# EasyEDA Pro project USB4 OF 1.eprj

# Schematic Schematic2
Board Name: PCB2; Create Date: 2025-10-10; Page Name: P1; Project Name: USB4 OF 1; Schematic Name: Schematic2; Update Date: 2025-10-12; Company: 嘉立创EDA; Page Size: A4; Version: V1.0
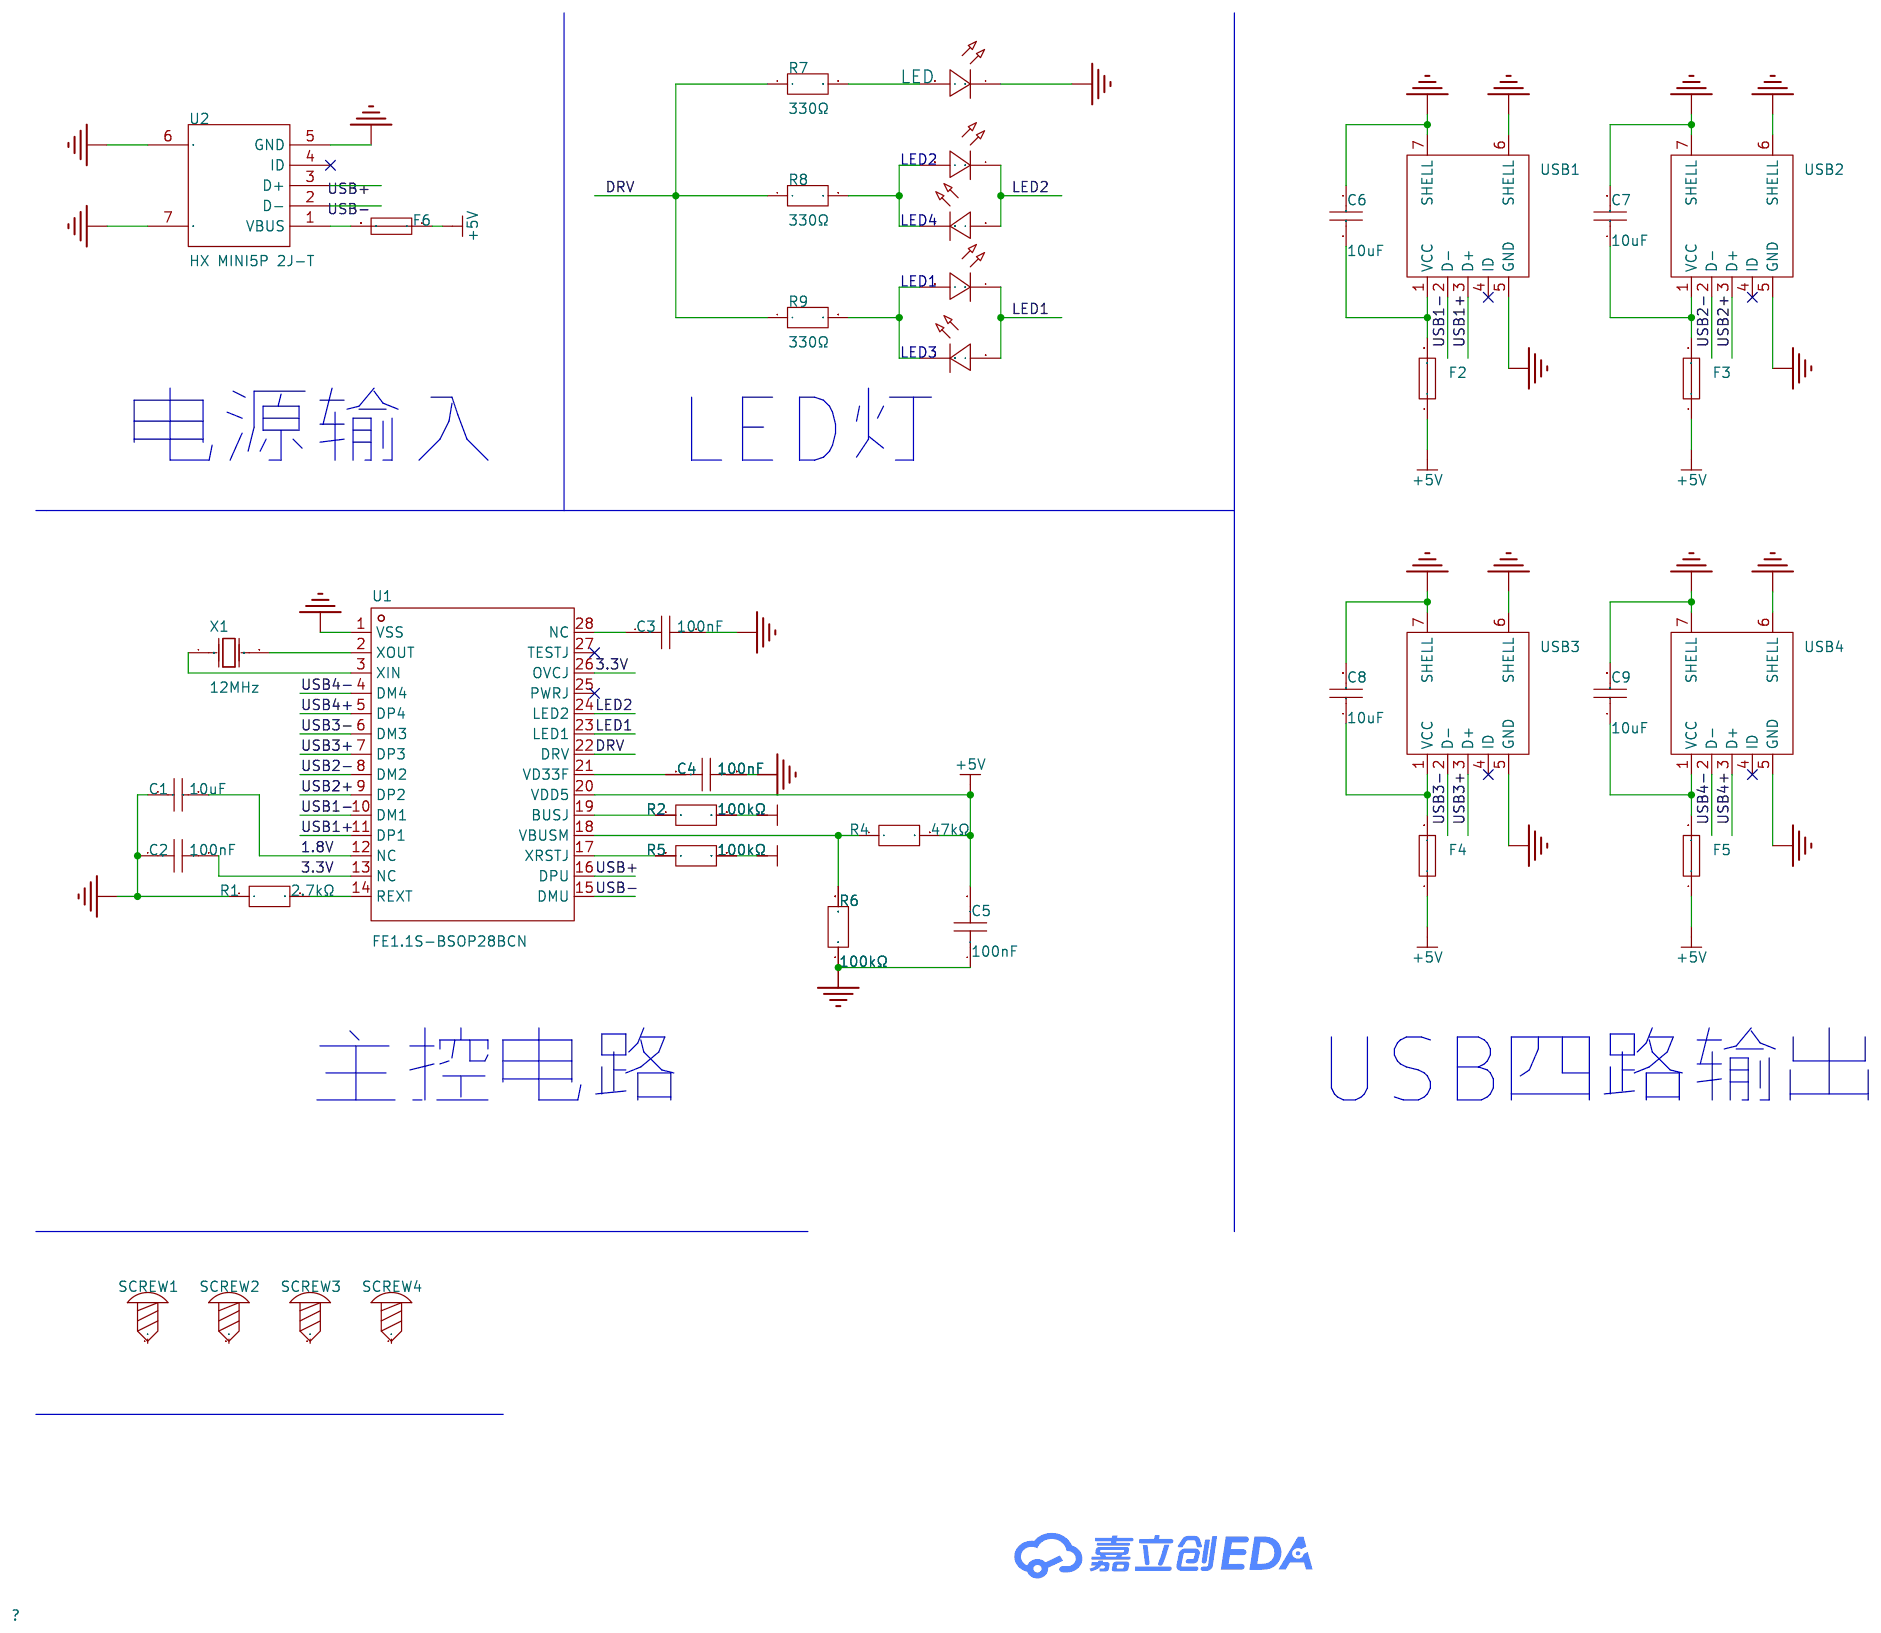
[diagram p0: schematic sheet]

## Parts
C1  10uF  [C0805]
C2  100nF  [C0402]
C3  100nF  [C0402]
C4  100nF  [C0402]
C5  100nF  [C0402]
C6  10uF  [C0805]
C7  10uF  [C0805]
C8  10uF  [C0805]
C9  10uF  [C0805]
F2  SMD1206-050  [F1206]
F3  SMD1206-050  [F1206]
F4  SMD1206-050  [F1206]
F5  SMD1206-050  [F1206]
F6  SMD1206-050  [F1206]
LED  -  [LED_0603]
LED1  -  [LED_0603]
LED2  -  [LED_0603]
LED3  -  [LED_0603]
LED4  -  [LED_0603]
R1  2.7kΩ  [R0603]
R2  100kΩ  [R0603]
R4  47kΩ  [R0805]
R5  100kΩ  [R0603]
R6  100kΩ  [R0603]
R7  330Ω  [R0402]
R8  330Ω  [R0402]
R9  330Ω  [R0402]
SCREW1  -  [M3螺丝]
SCREW2  -  [M3螺丝]
SCREW3  -  [M3螺丝]
SCREW4  -  [M3螺丝]
U1  FE1.1S-BSOP28BCN  [SSOP-28_L9.9-W3.9-P0.635-LS6.0-BL-1]
U2  HX MINI5P 2J-T  [USB-MINI-SMD_HX-MINI5P-2J-T]
USB1  MINI5P 180°T  [MINI-USB-TH_MINI5P-180T]
USB2  MINI5P 180°T  [MINI-USB-TH_MINI5P-180T]
USB3  MINI5P 180°T  [MINI-USB-TH_MINI5P-180T]
USB4  MINI5P 180°T  [MINI-USB-TH_MINI5P-180T]
X1  12MHz  [CRYSTAL-SMD_L7.0-W4.0-LS7.8]

## Library data of the parts
C1 C6-C9 = CL21A106KOQNNNE: 容值:10uF;精度:±10%;额定电压:16V;温度系数:X5R;; LCSC Part Name: 10uF ±10% 16V; Supplier Part: C1713; Manufacturer: SAMSUNG(三星); Supplier Footprint: 0805; JLCPCB Part Class: 扩展库; Datasheet: https://item.szlcsc.com/datasheet/CL21A106KOQNNNE/2065.html; Supplier: LCSC; Tolerance: ±10%; Voltage Rating: 16V; Temperature Coefficient: X5R
C2-C5 = CL05B104KO5NNNC: 容值:100nF;精度:±10%;额定电压:16V;温度系数:X7R;; LCSC Part Name: 100nF ±10% 16V; Supplier Part: C1525; Manufacturer: SAMSUNG(三星); Supplier Footprint: 0402; JLCPCB Part Class: 基础库; Datasheet: https://item.szlcsc.com/datasheet/CL05B104KO5NNNC/1877.html; Supplier: LCSC; Tolerance: ±10%; Voltage Rating: 16V; Temperature Coefficient: X7R
F2-F6 = SMD1206-050: 耐压(Vmax):6V;最大电流(Imax):8A;保持电流(Ihold):500mA;跳闸电流(Itrip):1A;; Supplier Part: C48995616; Manufacturer: Semiwell(矽门微); Supplier Footprint: 1206; JLCPCB Part Class: 扩展库; Datasheet: https://item.szlcsc.com/datasheet/SMD1206-050/51331345.html; Supplier: LCSC; Voltage - Max: 6V; Current - Max: 8A; Hold Current: 500mA; Trip Current: 1A; Power Dissipation: 600mW; Resistance - Initial (Ri) (Min): 150mΩ; Resistance - Post Trip (R1) (Max): 700mΩ; Time to Trip(Max): 100ms; Operating Temperature: -40℃~+85℃; Length: 3.6mm; Width: 1.9mm; Height: 1.2mm
LED = LED_0603-R: Supplier Footprint: 0603
LED1-LED4 = LED_0603-G: Supplier Footprint: 0603
R1 = FRC0603F2701TS: 电阻类型:厚膜电阻;阻值:2.7kΩ;精度:±1%;功率:100mW;工作电压:75V;温度系数:±100ppm/℃;; LCSC Part Name: 2.7kΩ ±1% 100mW 厚膜电阻; Supplier Part: C2907008; Manufacturer: FOJAN(富捷); Supplier Footprint: 0603; JLCPCB Part Class: 扩展库; Supplier: LCSC; Type: 厚膜电阻; Tolerance: ±1%; Power(Watts): 100mW; Voltage-Supply(Max): 75V; Temperature Coefficient: ±100ppm/℃; Operating Temperature: -55℃~+155℃
R2 R5 R6 = FRC0603J104 TS: 电阻类型:厚膜电阻;阻值:100kΩ;精度:±5%;功率:100mW;工作电压:75V;温度系数:±100ppm/℃;; LCSC Part Name: 100kΩ ±5% 100mW 厚膜电阻; Supplier Part: C2907088; Manufacturer: FOJAN(富捷); Supplier Footprint: 0603; JLCPCB Part Class: 扩展库; Supplier: LCSC; Type: 厚膜电阻; Tolerance: ±5%; Power(Watts): 100mW; Voltage-Supply(Max): 75V; Temperature Coefficient: ±100ppm/℃; Operating Temperature: -55℃~+155℃
R4 = FRC0805J473 TS: 电阻类型:厚膜电阻;阻值:47kΩ;精度:±5%;功率:125mW;工作电压:150V;温度系数:±100ppm/℃;; LCSC Part Name: 47kΩ ±5% 125mW 厚膜电阻; Supplier Part: C2907330; Manufacturer: FOJAN(富捷); Supplier Footprint: 0805; JLCPCB Part Class: 扩展库; Supplier: LCSC; Type: 厚膜电阻; Tolerance: ±5%; Power(Watts): 125mW; Voltage-Supply(Max): 150V; Temperature Coefficient: ±100ppm/℃; Operating Temperature: -55℃~+155℃
R7-R9 = FRC0402J331 TS: 电阻类型:厚膜电阻;阻值:330Ω;精度:±5%;功率:62.5mW;工作电压:50V;温度系数:±100ppm/℃;; LCSC Part Name: 330Ω ±5% 62.5mW 厚膜电阻; Supplier Part: C2906929; Manufacturer: FOJAN(富捷); Supplier Footprint: 0402; JLCPCB Part Class: 扩展库; Supplier: LCSC; Type: 厚膜电阻; Tolerance: ±5%; Power(Watts): 62.5mW; Voltage-Supply(Max): 50V; Temperature Coefficient: ±100ppm/℃; Operating Temperature: -55℃~+155℃
SCREW1-SCREW4 = M3螺丝: Supplier Footprint: 插件
U1 = FE1.1S-BSOP28BCN: 应用功能:-;接口协议:-;; LCSC Part Name: FE1.1s - USB 2.0高速4端口集线器控制器; Supplier Part: C9359; Manufacturer: TERMINUS; Supplier Footprint: SSOP-28-150mil; JLCPCB Part Class: 扩展库; Datasheet: https://atta.szlcsc.com/upload/public/pdf/source/20230317/CF3CD0767291E55840676FE9156E5488.pdf; Supplier: LCSC
U2 = HX MINI5P 2J-T: LCSC Part Name: Mini-B 母 弯插; Supplier Part: C19189144; Manufacturer: hanxia(韩下); Supplier Footprint: 弯插; JLCPCB Part Class: 扩展库; Datasheet: https://item.szlcsc.com/datasheet/HX%2520MINI5P%25202J-T/20414140.html; Supplier: LCSC; Connector Type: Mini-B; Protocol Standard: USB 2.0; Gender: 母; Mounting Type: 弯插; Number of Contacts: 5P; Number of Ports: 1; Current Rating-Power: 1A; Voltage Rating: 30V; Connect-Disconnect Life: 3千次; Length: 9.2mm; Detection color: 黑色; Operating Temperature: -30℃~+80℃
USB1-USB4 = MINI5P 180°T: 连接器类型:Mini-B;协议标准:USB 2.0;公母:母;安装方式:直插;触点数量:5P;端口数量:1;额定电流 - 电源:1A;工作温度:-25℃~+85℃;; LCSC Part Name: Mini-B 母 弯插; Supplier Part: C6331167; Manufacturer: SHOU HAN(首韩); Supplier Footprint: 插件; JLCPCB Part Class: 扩展库; Datasheet: https://item.szlcsc.com/datasheet/MINI5P%2520180%25C2%25B0T/7279360.html; Supplier: LCSC; Connector Type: Mini-B; Protocol Standard: USB 2.0; Gender: 母; Mounting Type: 直插; Number of Contacts: 5P; Number of Ports: 1; Current Rating-Power: 1A; Voltage Rating: 30V; Connect-Disconnect Life: 3千次; Length: 9.5mm; Detection color: 黑色; Operating Temperature: -25℃~+85℃
X1 = 12M 20PF 10PPM: 频率:12MHz;常温频差:±10ppm;负载电容:20pF;频率稳定度:±30ppm;; LCSC Part Name: 12MHz ±10ppm 20pF; Supplier Part: C2975358; Manufacturer: SOSET(索斯特); Supplier Footprint: HC-49S-SMD-2P-Mini; JLCPCB Part Class: 扩展库; Datasheet: https://item.szlcsc.com/datasheet/12M%252020PF%252010PPM/3379869.html; Supplier: LCSC; Normal temperature Frequency Tolerance: ±10ppm; Load Capacitance: 20pF; Frequency Stability: ±30ppm; Operating Temperature: -20℃~+70℃

## Nets
1.8V: C1.2 U1.12(NC)
3.3V: C2.2 R2.2 R5.2 U1.13(NC) U1.26(OVCJ)
+5V: C5.2 F2.1 F3.1 F4.1 F5.1 F6.1 R4.2 U1.20(VDD5)
GND: C1.1 C2.1 C3.2 C4.2 C5.1 C6.1 C7.2 C8.2 C9.2 LED.1(C) R1.1 R6.1 U1.1(VSS) U2.5(GND) U2.6(EH) U2.7(EH) USB1.5(GND) USB1.6(SHELL) USB1.7(SHELL) USB2.5(GND) USB2.6(SHELL) USB2.7(SHELL) USB3.5(GND) USB3.6(SHELL) USB3.7(SHELL) USB4.5(GND) USB4.6(SHELL) USB4.7(SHELL)
DRV: R7.1 R8.1 R9.1 U1.22(DRV)
LED1: LED1.1(C) LED3.2(A) U1.23(LED1)
LED2: LED2.1(C) LED4.2(A) U1.24(LED2)
USB1+: U1.11(DP1) USB1.3(D+)
USB1-: U1.10(DM1) USB1.2(D-)
USB2+: U1.9(DP2) USB2.3(D+)
USB2-: U1.8(DM2) USB2.2(D-)
USB3+: U1.7(DP3) USB3.3(D+)
USB3-: U1.6(DM3) USB3.2(D-)
USB4+: U1.5(DP4) USB4.3(D+)
USB4-: U1.4(DM4) USB4.2(D-)
USB+: U1.16(DPU) U2.3(D+)
USB-: U1.15(DMU) U2.2(D-)
$1N1246: U1.2(XOUT) X1.2(OSC2)
$1N1259: U1.3(XIN) X1.1(OSC1)
$1N1264: R1.2 U1.14(REXT)
$1N1680: C3.1 U1.28(NC)
$1N1741: C4.1 U1.21(VD33F)
$1N1878: R2.1 U1.19(BUSJ)
$1N1882: R5.1 U1.17(XRSTJ)
$1N2115: R4.1 R6.2 U1.18(VBUSM)
$1N2721: C6.2 F2.2 USB1.1(VCC)
$1N3229: C7.1 F3.2 USB2.1(VCC)
$1N3435: C8.1 F4.2 USB3.1(VCC)
$1N3641: C9.1 F5.2 USB4.1(VCC)
$1N3817: LED.2(A) R7.2
$1N3890: LED2.2(A) LED4.1(C) R8.2
$1N3921: LED1.2(A) LED3.1(C) R9.2
Net-(F6-2): F6.2 U2.1(VBUS)

Not connected (* = marked no-connect by the designer): SCREW1 1; SCREW2 1; SCREW3 1; SCREW4 1; U1 25(PWRJ)* 27(TESTJ)*; U2 4(ID)*; USB1 4(ID)*; USB2 4(ID)*; USB3 4(ID)*; USB4 4(ID)*

## Notes on the sheet
- 电源输入
- LED灯
- 主控电路
- USB四路输出

# Board PCB2
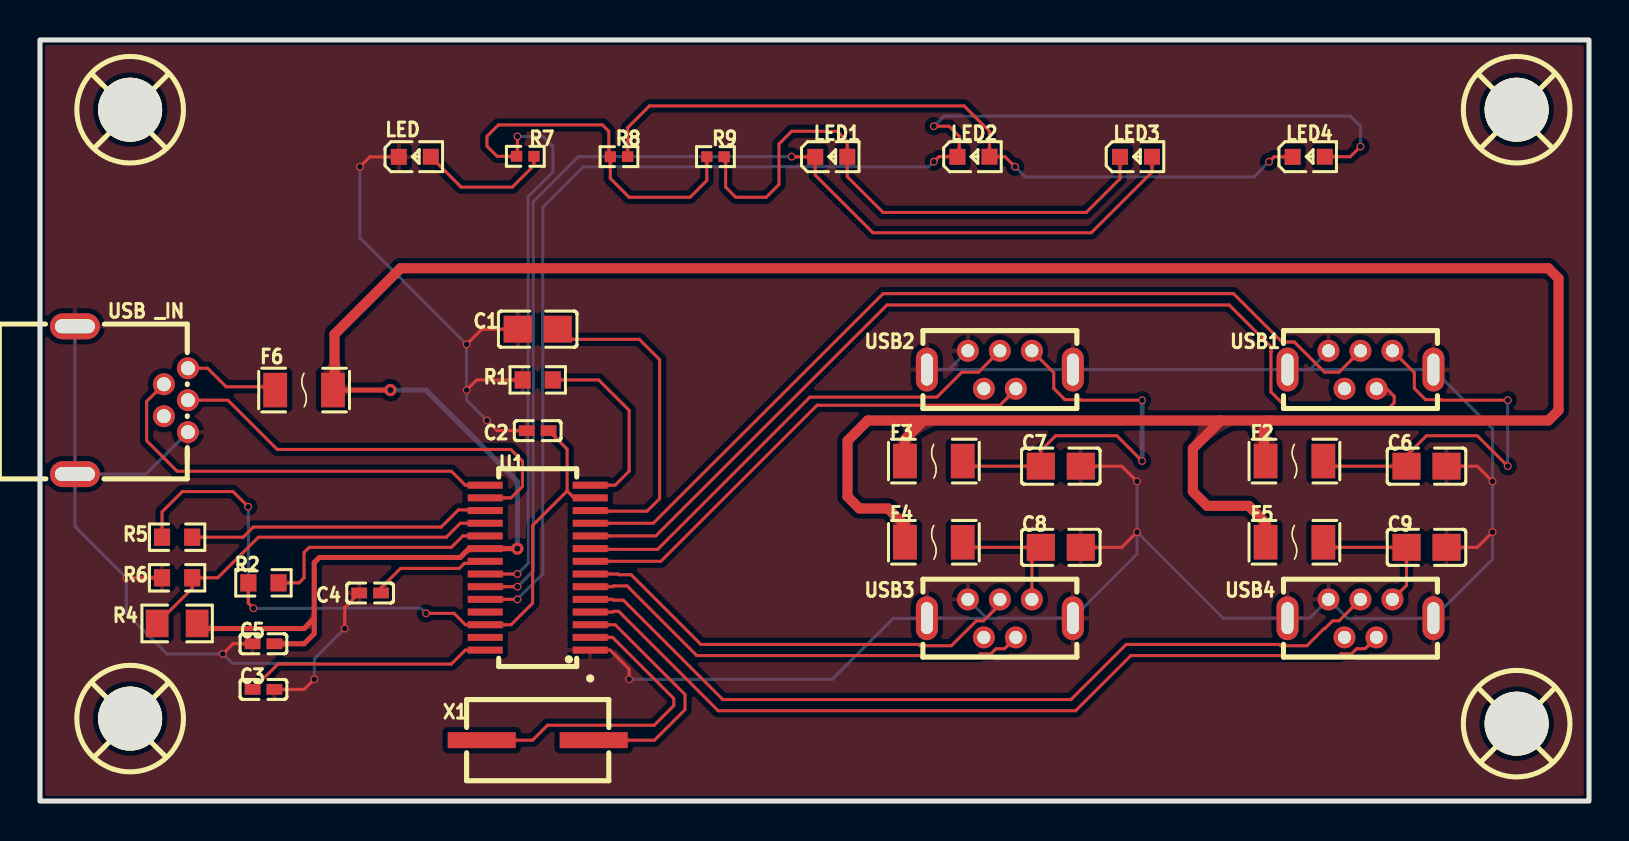
[diagram p1: board, top side]
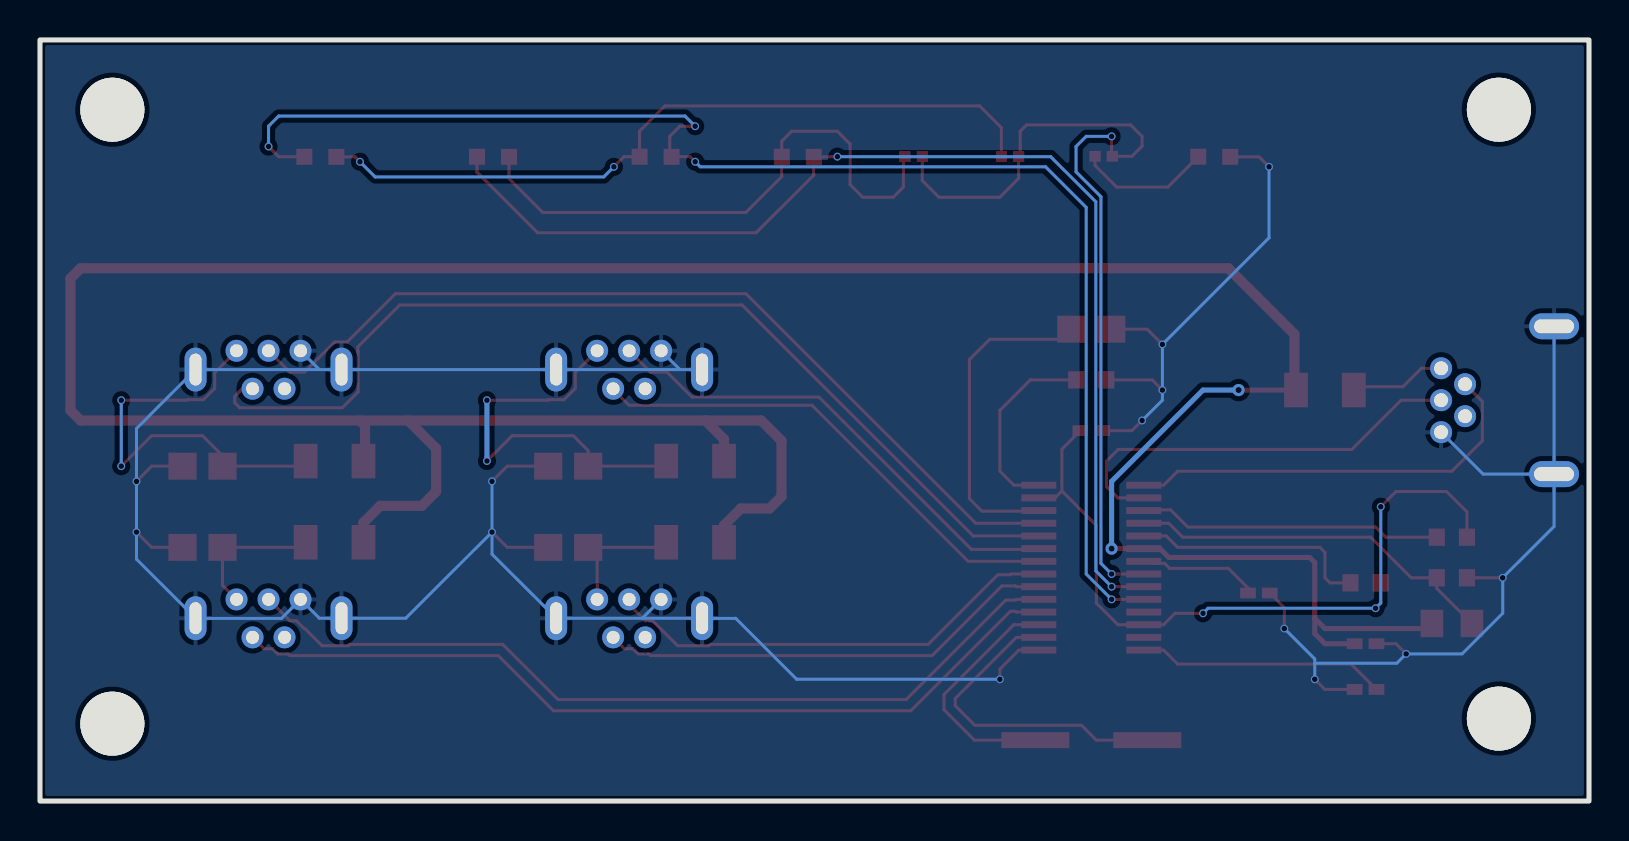
[diagram p2: board, bottom side, seen from below]

Outline 77.47 x 38.1 mm; copper layers: Top Layer, Bottom Layer. Coordinates in mm from the lower left corner of the outline.
Outline path: rectangle 0,38.1 77.47,0
Stack: Top Layer 0.035mm / Dielectric1 1.51mm FR4 er 4.5 / Bottom Layer 0.035mm

## Design rules (mm)
net USB+: DP1
net USB-: DP1
net USB1+: USB1
net USB1-: USB1
net USB2+: USB2
net USB2-: USB2
net USB3+: USB3
net USB3-: USB3
net USB4+: USB4
net USB4-: USB4
template: 自定义配置
spacing copperThickness1oz (default): track to track 0.102, other pairs 0.152 to 0.3
spacing copperThickness2oz: track to track 0.203, other pairs 0.152 to 0.3
track width copperThickness1oz (default): min 0.127, default 0.254, max 2.54
track width copperThickness2oz: min 0.203, default 0.254, max 2.54
differential pair differentialPair (default): width min 0.127, default 0.254, max 2.54; gap min 0.001, default 0.305
via viaSize (default): diameter min 0.356, default 0.394, max 10; hole min 0.254, default 0.279, max 6.3

## Placement (name value [footprint] x y rotation side)
C1  10uF  [C0805]  24.89 23.62 0 top
C2  100nF  [C0402]  24.89 18.54 0 top
C3  100nF  [C0402]  11.18 5.59 0 top
C4  100nF  [C0402]  16.51 10.41 180 top
C5  100nF  [C0402]  11.18 7.87 0 top
C6  10uF  [C0805]  69.34 16.76 180 top
C7  10uF  [C0805]  51.05 16.76 0 top
C8  10uF  [C0805]  51.05 12.7 0 top
C9  10uF  [C0805]  69.34 12.7 0 top
F2  SMD1206-050  [F1206]  62.74 17.02 0 top
F3  SMD1206-050  [F1206]  44.7 17.02 0 top
F4  SMD1206-050  [F1206]  44.7 12.95 0 top
F5  SMD1206-050  [F1206]  62.74 12.95 0 top
F6  SMD1206-050  [F1206]  13.21 20.57 180 top
LED  -  [LED_0603]  18.8 32.26 0 top
LED1  -  [LED_0603]  39.62 32.26 0 top
LED2  -  [LED_0603]  46.74 32.26 0 top
LED3  -  [LED_0603]  54.86 32.26 0 top
LED4  -  [LED_0603]  63.5 32.26 0 top
R1  2.7kΩ  [R0603]  24.89 21.08 0 top
R2  100kΩ  [R0603]  11.18 10.92 180 top
R4  47kΩ  [R0805]  6.86 8.89 0 top
R5  100kΩ  [R0603]  6.86 13.21 180 top
R6  100kΩ  [R0603]  6.86 11.18 0 top
R7  330Ω  [R0402]  24.27 32.28 0 top
R8  330Ω  [R0402]  28.96 32.26 0 top
R9  330Ω  [R0402]  33.78 32.26 0 top
SCREW1  -  [M3螺丝]  4.57 34.54 0 top
SCREW2  -  [M3螺丝]  4.57 4.06 0 top
SCREW3  -  [M3螺丝]  73.91 34.54 0 top
SCREW4  -  [M3螺丝]  73.91 3.81 0 top
U1  FE1.1S-BSOP28BCN  [SSOP-28_L9.9-W3.9-P0.635-LS6.0-BL-1]  24.89 11.68 90 top
USB1  MINI5P 180°T  [MINI-USB-TH_MINI5P-180T]  66.04 21.59 0 top
USB2  MINI5P 180°T  [MINI-USB-TH_MINI5P-180T]  48.01 21.59 0 top
USB3  MINI5P 180°T  [MINI-USB-TH_MINI5P-180T]  48.01 9.14 0 top
USB4  MINI5P 180°T  [MINI-USB-TH_MINI5P-180T]  66.04 9.14 0 top
USB _IN  HX MINI5P 2J-T  [USB-MINI-SMD_HX-MINI5P-2J-T]  4.57 20.07 270 top
X1  12MHz  [CRYSTAL-SMD_L7.0-W4.0-LS7.8]  24.89 3.05 180 top

## Footprints (pads in the part's own frame, mm; a bottom-side part is the same pattern mirrored in y, then rotated)
C0402
  rect 0.79x0.54 smd: 1(-0.545,0) 2(0.545,0)
C0805
  rect 1.41x1.35 smd: 1(-1,0) 2(1,0)
CRYSTAL-SMD_L7.0-W4.0-LS7.8
  rect 3.4x0.8 smd: 1(-2.8,0) 2(2.8,0)
F1206
  rect 1.19x1.728 smd: 1(-1.445,0) 2(1.445,0)
LED_0603
  rect 0.8x0.8 smd: 1(-0.851,-0.01) 2(0.75,-0.005)
M3螺丝
  round 3.2 hole 3.2: 1(-0.064,0.064)
MINI-USB-TH_MINI5P-180T
  round 1.1 hole 0.65: 1(1.6,0.95) 2(0.8,-0.95) 3(0,0.95) 4(-0.8,-0.95) 5(-1.6,0.95)
  oval 1.1x2.2 hole 0.6x1.6: 6(3.65,0.01) 7(-3.65,0.01)
R0402
  rect 0.566x0.54 smd: 1(-0.433,0) 2(0.433,0)
R0603
  rect 0.806x0.864 smd: 1(-0.753,0) 2(0.753,0)
R0805
  rect 1.133x1.377 smd: 1(-1,0) 2(1,0)
SSOP-28_L9.9-W3.9-P0.635-LS6.0-BL-1
  rect 0.35x1.751 smd: 1(-4.128,-2.626) 2(-3.493,-2.626) 3(-2.857,-2.626) 4(-2.223,-2.626) 5(-1.587,-2.626) 6(-0.953,-2.626) 7(-0.318,-2.626) 8(0.318,-2.626) 9(0.953,-2.626) 10(1.587,-2.626) 11(2.223,-2.626) 12(2.857,-2.626) 13(3.493,-2.626) 14(4.128,-2.626) 15(4.128,2.626) 16(3.493,2.626) 17(2.857,2.626) 18(2.223,2.626) 19(1.587,2.626) 20(0.953,2.626) 21(0.318,2.626) 22(-0.318,2.626) 23(-0.953,2.626) 24(-1.587,2.626) 25(-2.223,2.626) 26(-2.857,2.626) 27(-3.493,2.626) 28(-4.128,2.626)
USB-MINI-SMD_HX-MINI5P-2J-T
  round 1.1 hole 0.7: 1(-1.6,2.825) 2(-0.8,1.625) 3(0,2.825) 4(0.8,1.625) 5(1.6,2.825)
  oval 1.3x2.5 hole 0.7x2: 6(3.7,-2.825) 7(-3.7,-2.825)

## Nets
As in the schematic, except:
GND: C1.1 C2.1 C3.2 C4.2 C5.1 C6.1 C7.2 C8.2 C9.2 LED.1 R1.1 R6.1 U1.1 USB1.5 USB1.6 USB1.7 USB2.5 USB2.6 USB2.7 USB3.5 USB3.6 USB3.7 USB4.5 USB4.6 USB4.7 USB _IN.5 USB _IN.6 USB _IN.7
USB+: U1.16 USB _IN.3
USB-: U1.15 USB _IN.2
$1N7306: F6.2 USB _IN.1

Pads without a net: SCREW1 1; SCREW2 1; SCREW3 1; SCREW4 1; U1 25 27; USB1 4; USB2 4; USB3 4; USB4 4; USB _IN 4

## Via types
v1: diameter 0.394, hole 0.28, Top Layer to Bottom Layer, 30 vias
v2: diameter 0.61, hole 0.305, Top Layer to Bottom Layer, 2 vias

## Routing (per net, layer and track width the routed paths; a pad name or vN(x,y) marks a point on that pad's centre or on a via; arc(x,y) is an arc through that point)
1.8V: length 16.4
  Top Layer w0.152: C1.2 26.4,23.11 29.97,23.11 30.99,22.1 30.99,15.14 30.36,14.51 27.55,14.51 U1.12
3.3V: length 38.7
  Top Layer w0.152: v1(10.41,14.73) 9.65,15.49 7.12,15.49 6.1,14.48 R5.2 ; 26.36,15.52 24.64,13.8 24.64,9.91 23.56,8.83 U1.26 21.28,8.83 20.7,9.4 v1(19.3,9.4) ; 26.36,15.52 26.36,17.62 C2.2 ; 26.36,15.52 26.71,15.18 U1.13 ; R2.2 10.42,9.91 v1(10.68,9.65)
  Bottom Layer w0.152: v1(10.41,14.73) 10.41,9.91 v1(10.68,9.65) 19.05,9.65 v1(19.3,9.4)
+5V: length 166.2
  Top Layer w0.254: C5.2 13.21,7.87 13.72,8.38 13.72,9.14 ; 13.72,9.14 13.21,8.64 8.11,8.64 R4.2 ; 13.72,9.14 13.72,11.94 13.97,12.19 21.01,12.19 21.46,12.64 U1.20 v2(23.88,12.64) ; v2(17.53,20.57) F6.1
  Top Layer w0.508: 61.47,19.05 61.21,18.8 61.21,17.1 61.29,17.02 ; 61.47,19.05 75.44,19.05 75.95,19.56 75.95,26.16 75.44,26.67 18.03,26.67 14.73,23.37 14.73,20.75 ; 61.47,19.05 59.06,19.05 ; F3.1 43.26,18.11 44.2,19.05 ; 59.06,19.05 44.2,19.05 ; 59.06,19.05 57.66,17.65 57.66,15.49 58.38,14.78 60.45,14.78 61.29,13.93 61.29,12.95 ; 44.2,19.05 41.4,19.05 40.39,18.03 40.39,15.24 40.98,14.64 42.42,14.64 43.26,13.8 F4.1
  Bottom Layer w0.254: v2(17.53,20.57) 19.3,20.57 23.88,16 v2(23.88,12.64)
GND: length 176.5
  Top Layer w0.152: v1(54.86,13.46) 54.1,12.7 C8.2 ; C9.2 71.88,12.7 v1(72.64,13.46) ; C7.2 54.1,16.76 v1(54.86,16) ; v1(29.46,6.1) 29.46,6.6 28.51,7.56 U1.1 ; C4.2 15.24,9.69 v1(15.24,8.64) ; v1(13.72,6.1) 13.21,5.59 C3.2 ; R6.1 v1(4.32,11.18) ; v1(16,31.75) 16.5,32.25 LED.1 ; R1.1 21.84,21.08 v1(21.34,20.57) ; C2.1 22.86,18.54 v1(22.35,19.05) ; C1.1 22.1,23.62 v1(21.34,22.86) ; C6.1 71.88,16.76 v1(72.64,16) ; v1(9.14,7.37) 9.65,7.87 C5.1
  Bottom Layer w0.152: 47.35,9.15 USB3.6 54.86,12.36 v1(54.86,13.46) ; 47.35,9.15 USB3.5 ; 47.35,9.15 USB3.7 44.35,9.14 42.67,9.14 39.62,6.1 v1(29.46,6.1) ; 13.72,6.9 v1(13.72,6.1) ; 13.72,6.9 13.72,7.11 v1(15.24,8.64) ; 13.72,6.9 9.61,6.9 v1(9.14,7.37) 6.35,7.37 4.32,9.4 v1(4.32,11.18) 1.75,13.75 USB _IN.6 ; v1(16,31.75) 16,28.19 v1(21.34,22.86) v1(21.34,20.57) 21.34,20.07 v1(22.35,19.05) ; 45.47,21.6 USB2.5 ; 45.47,21.6 USB2.7 ; 45.47,21.6 USB2.6 USB1.7 63.5,21.6 ; v1(54.86,13.46) v1(54.86,16) ; v1(54.86,13.46) 59.17,9.15 USB4.7 63.5,9.15 USB4.5 65.39,9.14 69.68,9.14 USB4.6 72.64,12.11 v1(72.64,13.46) v1(72.64,16) 72.64,18.65 USB1.6 63.5,21.6 ; 63.5,21.6 USB1.5 ; USB _IN.7 USB _IN.6 ; USB _IN.6 5.3,16.37 USB _IN.5
DRV: length 44.5
  Top Layer w0.152: R9.1 33.35,31.06 32.51,30.23 29.46,30.23 28.52,31.17 R8.1 28.45,32.33 28.45,33.53 28.13,33.85 22.92,33.85 22.35,33.27 22.35,32.78 22.86,32.28 R7.1 23.88,32.31 v1(23.88,33.27) ; U1.22 v1(23.88,11.37)
  Bottom Layer w0.152: v1(23.88,11.37) 24.41,11.9 24.41,30.25 25.65,31.5 25.65,32.77 25.15,33.27 v1(23.88,33.27)
LED1: length 57.2
  Top Layer w0.152: v1(37.59,32.26) 37.6,32.25 LED1.1 38.77,31.33 41.66,28.45 52.58,28.45 55.61,31.48 LED3.2 ; U1.23 v1(23.88,10.73)
  Bottom Layer w0.152: v1(23.88,10.73) 24.66,11.52 24.66,30 26.92,32.26 v1(37.59,32.26)
LED2: length 70.9
  Top Layer w0.152: v1(66.04,32.77) 65.53,32.25 LED4.2 ; U1.24 v1(23.88,10.1) ; v1(44.7,32) 44.96,32.26 45.88,32.26 LED2.1 45.97,32.34 45.97,33.27 45.47,33.78 v1(44.7,33.78)
  Bottom Layer w0.152: v1(44.7,33.78) 45.21,34.29 65.53,34.29 66.04,33.78 v1(66.04,32.77) ; v1(23.88,10.1) 25.15,11.37 25.15,29.72 27.18,31.75 44.45,31.75 v1(44.7,32)
USB1+: length 45.4
  Top Layer w0.152: U1.11 30.67,13.91 42.16,25.4 59.69,25.4 62.11,22.98 62.73,22.98 64.24,21.47 64.97,21.47 USB1.3
USB1-: length 50
  Top Layer w0.152: U1.10 30.8,13.27 42.36,24.83 59.48,24.83 61.57,22.73 61.57,22.51 61.56,22.49 61.56,20.48 62.36,19.68 67.48,19.68 67.73,19.94 67.73,20.26 67.22,20.77 66.97,20.77 USB1.2
USB2+: length 24.6
  Top Layer w0.152: U1.9 27.56,12.6 30.89,12.6 38.51,20.22 44.86,20.22 46.11,21.47 46.94,21.47 USB2.3
USB2-: length 24.9
  Top Layer w0.152: U1.8 31.05,12 38.86,19.81 48.01,19.81 48.81,20.61 USB2.2
USB3+: length 23.1
  Top Layer w0.152: USB3.3 48.01,9.84 47.19,9.02 46.83,9.02 45.58,7.77 44.01,7.77 43.95,7.84 33.05,7.84 29.57,11.33 28.94,11.33 28.9,11.37 U1.7
USB3-: length 23.1
  Top Layer w0.152: USB3.2 48.24,7.63 47.81,7.63 47.55,7.36 47.02,7.36 46.94,7.28 32.85,7.28 29.36,10.77 28.69,10.77 28.65,10.73 U1.6
USB4+: length 42.7
  Top Layer w0.152: U1.5 28.65,10.1 28.69,10.06 29.17,10.06 34.15,5.08 51.56,5.08 54.32,7.84 61.98,7.84 62.05,7.77 63.36,7.77 64.22,8.64 64.26,8.64 64.65,9.02 64.97,9.02 USB4.3
USB4-: length 42.9
  Top Layer w0.152: U1.4 28.65,9.46 28.69,9.5 28.94,9.5 33.92,4.52 51.79,4.52 54.55,7.28 64.97,7.28 65.06,7.36 65.58,7.36 65.84,7.63 66.27,7.63 USB4.2
USB+: length 21.4
  Top Layer w0.152: U1.16 23.56,15.18 24.13,15.75 24.13,17.02 23.55,17.6 11.86,17.6 9.4,20.07 USB _IN.3
USB-: length 21
  Top Layer w0.152: U1.15 21.27,15.81 20.57,16.51 6.86,16.51 5.33,18.03 5.33,20 USB _IN.2
$1N1246: length 16.1
  Top Layer w0.152: X1.2 24.64,3.05 25.38,3.79 30.72,3.79 31.7,4.77 31.7,5.13 28.64,8.19 U1.2
$1N1259: length 12.1
  Top Layer w0.152: U1.3 28.77,8.83 32.26,5.33 32.26,4.57 30.73,3.05 X1.1
$1N1264: length 9.7
  Top Layer w0.152: R1.2 27.94,21.08 29.46,19.56 29.46,16.51 28.77,15.81 U1.14
$1N1680: length 12.5
  Top Layer w0.152: U1.28 21.27,7.56 20.57,6.86 11.9,6.86 C3.1
$1N1741: length 6
  Top Layer w0.152: U1.21 21.87,12 21.77,11.9 21.22,11.9 20.97,11.65 18.03,11.65 17.06,10.67 C4.1
$1N1878: length 12.1
  Top Layer w0.152: U1.19 21.15,13.27 20.57,12.7 13.46,12.7 13.21,12.45 13.21,11.18 12.95,10.92 R2.1
$1N1882: length 15.2
  Top Layer w0.152: R5.1 10.16,13.21 10.67,13.72 20.07,13.72 20.92,14.57 22.23,14.57 U1.17
$1N2115: length 18.8
  Top Layer w0.152: R4.1 7.61,10.64 R6.2 8.89,11.18 10.92,13.21 20.32,13.21 21.02,13.91 U1.18
$1N2721: length 21.2
  Top Layer w0.152: F2.2 64.44,16.76 C6.2 68.34,17.29 69.34,18.29 71.88,18.29 v1(73.41,16.76) ; USB1.1 68.73,21.45 68.73,20.65 69.29,20.09 70.09,20.09 70.11,20.07 73.15,20.07
  Bottom Layer w0.152: v1(73.41,20.07) v1(73.41,16.76)
$1N3229: length 20.5
  Top Layer w0.152: 54.86,20.07 52.08,20.07 52.05,20.09 51.26,20.09 50.7,20.65 50.7,21.45 USB2.1 ; F3.2 46.4,16.76 C7.1 50.05,17.54 50.8,18.29 53.85,18.29 v1(55.12,17.02)
  Bottom Layer w0.254: v1(55.12,20.07) v1(55.12,17.02)
$1N3435: length 6.8
  Top Layer w0.152: USB3.1 49.61,12.25 C8.1 46.4,12.7 F4.2
$1N3641: length 7.2
  Top Layer w0.152: USB4.1 68.34,10.8 C9.1 64.44,12.7 F5.2
$1N3817: length 6.7
  Top Layer w0.152: LED.2 21.06,30.73 23.62,30.73 24.7,31.82 R7.2
$1N3890: length 37.8
  Top Layer w0.152: v1(48.77,31.75) 48.27,32.25 LED2.2 47.49,33.53 46.22,34.8 30.48,34.8 29.39,33.71 R8.2 ; v1(61.47,32) 61.71,32.25 LED4.1
  Bottom Layer w0.152: v1(61.47,32) 60.71,31.24 49.28,31.24 v1(48.77,31.75)
$1N3921: length 28.3
  Top Layer w0.152: 54.01,32.25 54.01,31.15 52.32,29.46 42.16,29.46 40.37,31.25 40.37,32 ; 34.22,32.26 34.29,32.18 34.29,30.73 34.8,30.23 36.32,30.23 36.96,30.86 36.96,32.89 37.59,33.53 39.88,33.53 40.37,33.03 LED1.2
$1N7306: length 4.8
  Top Layer w0.152: F6.2 11.6,20.74 9.31,20.74 8.38,21.67 USB _IN.1

## Copper pours and planes (outline as drawn; the poured copper is in the pictures)
GND on Top Layer: 0,38.1 77.47,38.1 77.47,0 0,0
GND on Bottom Layer: 0,38.1 77.47,38.1 77.47,0 0,0

Small or netless copper shapes (teardrops, artwork), in the pictures only: 141 on Top Layer, 62 on Bottom Layer
